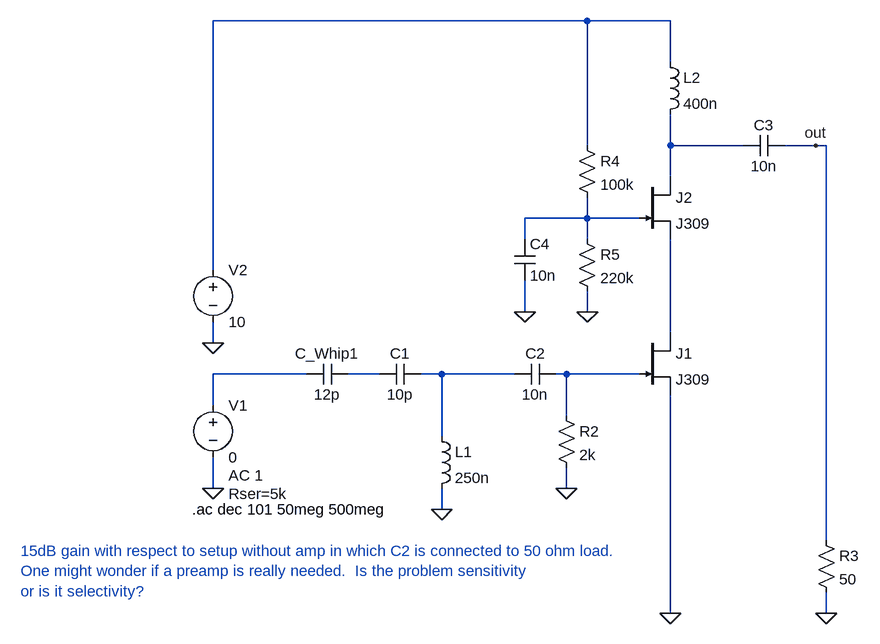
[diagram p0: schematic jfet.asc]
jfet.asc, the LTspice schematic file:
Version 4
SHEET 1 880 680
WIRE 304 -560 -272 -560
WIRE 432 -560 304 -560
WIRE 432 -496 432 -560
WIRE 304 -368 304 -560
WIRE 432 -368 432 -416
WIRE 544 -368 432 -368
WIRE 656 -368 608 -368
WIRE 672 -368 656 -368
WIRE 432 -320 432 -368
WIRE 304 -256 304 -288
WIRE 304 -256 208 -256
WIRE 384 -256 304 -256
WIRE 208 -224 208 -256
WIRE 304 -224 304 -256
WIRE -272 -176 -272 -560
WIRE 208 -112 208 -160
WIRE 304 -112 304 -144
WIRE 432 -80 432 -224
WIRE -272 -64 -272 -96
WIRE -128 -16 -272 -16
WIRE -16 -16 -64 -16
WIRE 80 -16 48 -16
WIRE 192 -16 80 -16
WIRE 272 -16 256 -16
WIRE 384 -16 272 -16
WIRE -272 32 -272 -16
WIRE 272 48 272 -16
WIRE 80 80 80 -16
WIRE -272 160 -272 112
WIRE 272 160 272 128
WIRE 80 192 80 160
WIRE 672 240 672 -368
WIRE 432 352 432 16
WIRE 672 352 672 320
FLAG -272 160 0
FLAG 80 192 0
FLAG -272 -64 0
FLAG 432 352 0
FLAG 272 160 0
FLAG 672 352 0
FLAG 304 -112 0
FLAG 208 -112 0
FLAG 656 -368 out
DATAFLAG 480 -368 ""
DATAFLAG 224 -256 ""
SYMBOL voltage -272 16 R0
WINDOW 123 24 124 Left 2
WINDOW 39 24 152 Left 2
SYMATTR Value2 AC 1
SYMATTR SpiceLine Rser=5k
SYMATTR InstName V1
SYMATTR Value 0
SYMBOL cap -64 -32 R90
WINDOW 0 0 32 VBottom 2
WINDOW 3 32 32 VTop 2
SYMATTR InstName C_Whip1
SYMATTR Value 12p
SYMBOL cap 48 -32 R90
WINDOW 0 0 32 VBottom 2
WINDOW 3 32 32 VTop 2
SYMATTR InstName C1
SYMATTR Value 10p
SYMBOL ind 64 64 R0
SYMATTR InstName L1
SYMATTR Value 250n
SYMBOL voltage -272 -192 R0
SYMATTR InstName V2
SYMATTR Value 10
SYMBOL cap 256 -32 R90
WINDOW 0 0 32 VBottom 2
WINDOW 3 32 32 VTop 2
SYMATTR InstName C2
SYMATTR Value 10n
SYMBOL res 256 32 R0
SYMATTR InstName R2
SYMATTR Value 2k
SYMBOL cap 608 -384 R90
WINDOW 0 0 32 VBottom 2
WINDOW 3 32 32 VTop 2
SYMATTR InstName C3
SYMATTR Value 10n
SYMBOL res 656 224 R0
SYMATTR InstName R3
SYMATTR Value 50
SYMBOL njf 384 -320 R0
SYMATTR InstName J2
SYMATTR Value J309
SYMBOL res 288 -384 R0
SYMATTR InstName R4
SYMATTR Value 100k
SYMBOL res 288 -240 R0
SYMATTR InstName R5
SYMATTR Value 220k
SYMBOL cap 192 -224 R0
SYMATTR InstName C4
SYMATTR Value 10n
SYMBOL ind 416 -512 R0
SYMATTR InstName L2
SYMATTR Value 400n
SYMBOL njf 384 -80 R0
SYMATTR InstName J1
SYMATTR Value J309
TEXT -304 192 Left 2 !.ac dec 101 50meg 500meg
TEXT -568 256 Left 2 ;15dB gain with respect to setup without amp in which C2 is connected to 50 ohm load.\nOne might wonder if a preamp is really needed.  Is the problem sensitivity\nor is it selectivity?

The netlist it stands for:
* jfet.asc
V1 N005 0 0 AC 1 Rser=5k
C_Whip1 N006 N005 12p
C1 N007 N006 10p
L1 N007 0 250n
V2 N001 0 10
C2 N008 N007 10n
R2 N008 0 2k
C3 out N002 10n
R3 out 0 50
J2 N002 N003 N004 J309
R4 N001 N003 100k
R5 N003 0 220k
C4 N003 0 10n
L2 N001 N002 400n
J1 N004 N008 0 J309
.model NJF NJF
.model PJF PJF
.lib standard.jft
.ac dec 101 50meg 500meg
* 15dB gain with respect to setup without amp in which C2 is connected to 50 ohm load.
* One might wonder if a preamp is really needed.  Is the problem sensitivity
* or is it selectivity?
.backanno
.end